# EAGLE schematic Main Board Schematic v13 (EAGLE 9.7.0)
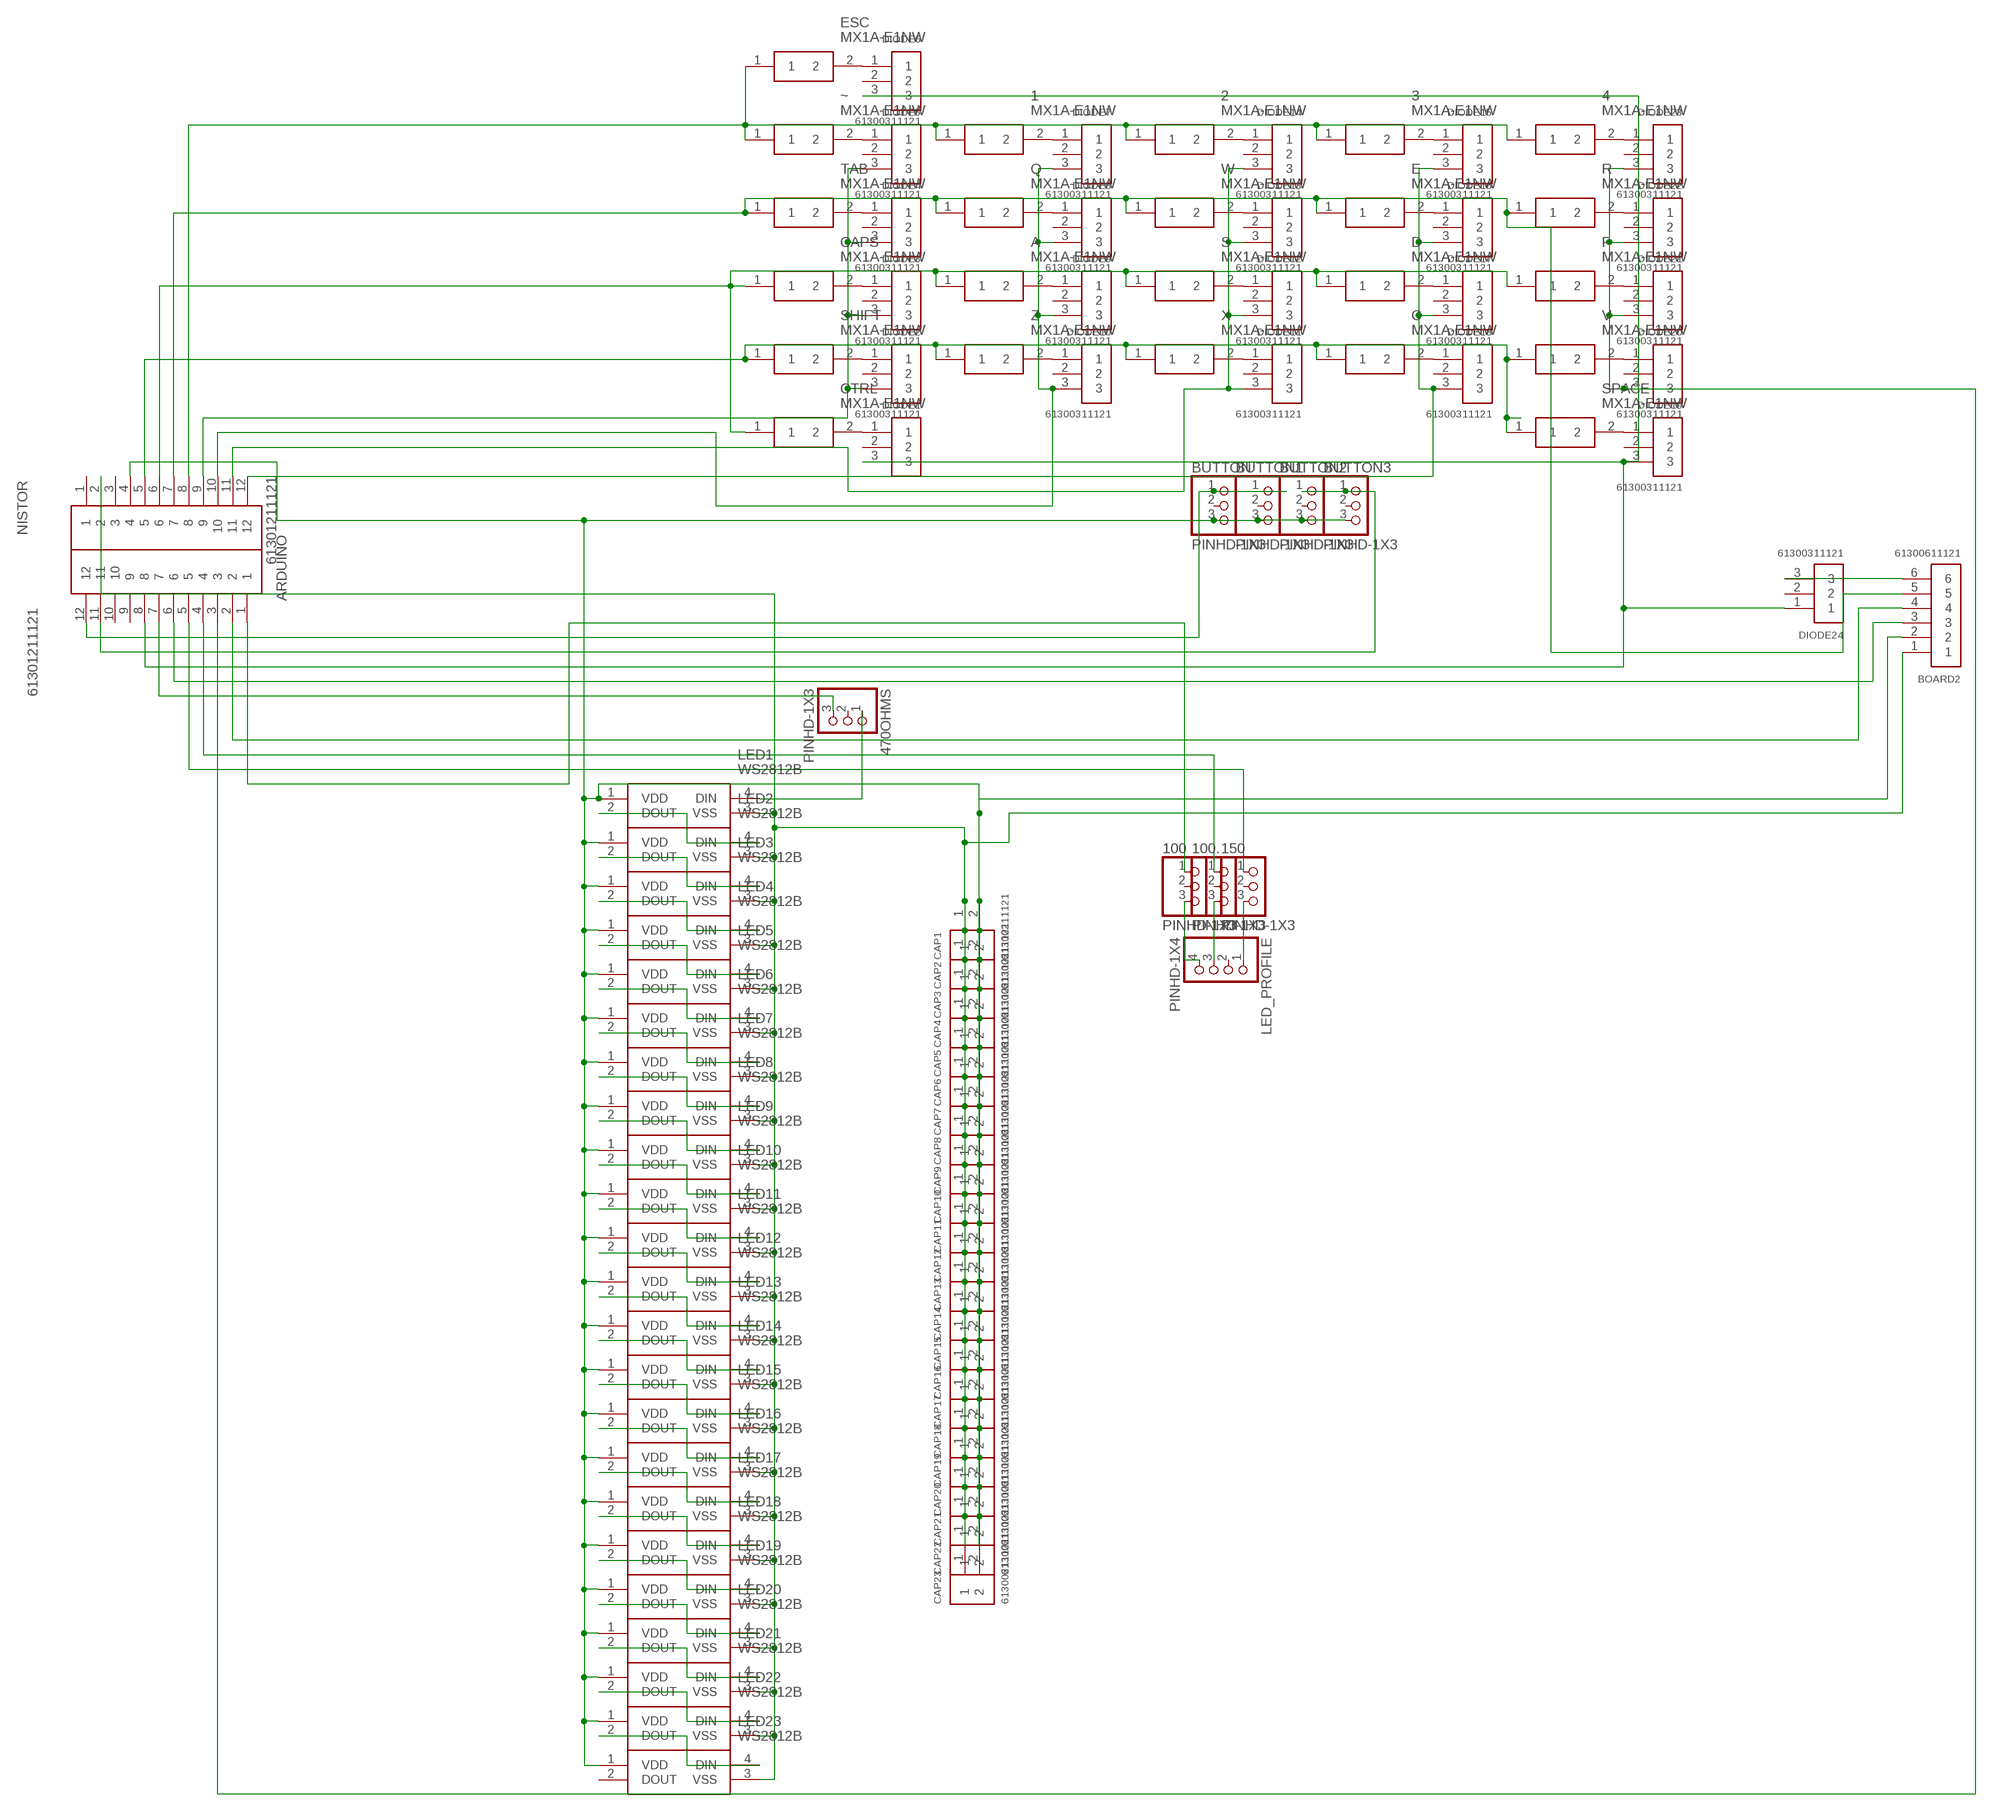
[diagram p0: schematic, sheet 1]

## Parts
1  MX1A-E1NW  [MX1AE1NW]
2  MX1A-E1NW  [MX1AE1NW]
3  MX1A-E1NW  [MX1AE1NW]
4  MX1A-E1NW  [MX1AE1NW]
100  PINHD-1X3  [1X03]
100.  PINHD-1X3  [1X03]
150  PINHD-1X3  [1X03]
470OHMS  PINHD-1X3  [1X03]
A  MX1A-E1NW  [MX1AE1NW]
ARDUINO  61301211121  [61301211121]
BOARD2  61300611121  [61300611121]
BUTTON  PINHD-1X3  [1X03]
BUTTON1  PINHD-1X3  [1X03]
BUTTON2  PINHD-1X3  [1X03]
BUTTON3  PINHD-1X3  [1X03]
C  MX1A-E1NW  [MX1AE1NW]
CAP1  61300211121  [61300211121]
CAP2  61300211121  [61300211121]
CAP3  61300211121  [61300211121]
CAP4  61300211121  [61300211121]
CAP5  61300211121  [61300211121]
CAP6  61300211121  [61300211121]
CAP7  61300211121  [61300211121]
CAP8  61300211121  [61300211121]
CAP9  61300211121  [61300211121]
CAP10  61300211121  [61300211121]
CAP11  61300211121  [61300211121]
CAP12  61300211121  [61300211121]
CAP13  61300211121  [61300211121]
CAP14  61300211121  [61300211121]
CAP15  61300211121  [61300211121]
CAP16  61300211121  [61300211121]
CAP17  61300211121  [61300211121]
CAP18  61300211121  [61300211121]
CAP19  61300211121  [61300211121]
CAP20  61300211121  [61300211121]
CAP21  61300211121  [61300211121]
CAP22  61300211121  [61300211121]
CAP23  61300211121  [61300211121]
CAPS  MX1A-E1NW  [MX1AE1NW]
CTRL  MX1A-E1NW  [MX1AE1NW]
D  MX1A-E1NW  [MX1AE1NW]
DIODE1  61300311121  [61300311121]
DIODE2  61300311121  [61300311121]
DIODE3  61300311121  [61300311121]
DIODE4  61300311121  [61300311121]
DIODE5  61300311121  [61300311121]
DIODE6  61300311121  [61300311121]
DIODE7  61300311121  [61300311121]
DIODE8  61300311121  [61300311121]
DIODE9  61300311121  [61300311121]
DIODE10  61300311121  [61300311121]
DIODE11  61300311121  [61300311121]
DIODE12  61300311121  [61300311121]
DIODE13  61300311121  [61300311121]
DIODE14  61300311121  [61300311121]
DIODE15  61300311121  [61300311121]
DIODE16  61300311121  [61300311121]
DIODE17  61300311121  [61300311121]
DIODE18  61300311121  [61300311121]
DIODE19  61300311121  [61300311121]
DIODE20  61300311121  [61300311121]
DIODE21  61300311121  [61300311121]
DIODE22  61300311121  [61300311121]
DIODE23  61300311121  [61300311121]
DIODE24  61300311121  [61300311121]
E  MX1A-E1NW  [MX1AE1NW]
ESC  MX1A-E1NW  [MX1AE1NW]
F  MX1A-E1NW  [MX1AE1NW]
LED1  WS2812B  [WS2812B]
LED2  WS2812B  [WS2812B]
LED3  WS2812B  [WS2812B]
LED4  WS2812B  [WS2812B]
LED5  WS2812B  [WS2812B]
LED6  WS2812B  [WS2812B]
LED7  WS2812B  [WS2812B]
LED8  WS2812B  [WS2812B]
LED9  WS2812B  [WS2812B]
LED10  WS2812B  [WS2812B]
LED11  WS2812B  [WS2812B]
LED12  WS2812B  [WS2812B]
LED13  WS2812B  [WS2812B]
LED14  WS2812B  [WS2812B]
LED15  WS2812B  [WS2812B]
LED16  WS2812B  [WS2812B]
LED17  WS2812B  [WS2812B]
LED18  WS2812B  [WS2812B]
LED19  WS2812B  [WS2812B]
LED20  WS2812B  [WS2812B]
LED21  WS2812B  [WS2812B]
LED22  WS2812B  [WS2812B]
LED23  WS2812B  [WS2812B]
LED_PROFILE  PINHD-1X4  [1X04]
NISTOR  61301211121  [61301211121]
Q  MX1A-E1NW  [MX1AE1NW]
R  MX1A-E1NW  [MX1AE1NW]
S  MX1A-E1NW  [MX1AE1NW]
SHIFT  MX1A-E1NW  [MX1AE1NW]
SPACE  MX1A-E1NW  [MX1AE1NW]
TAB  MX1A-E1NW  [MX1AE1NW]
V  MX1A-E1NW  [MX1AE1NW]
W  MX1A-E1NW  [MX1AE1NW]
X  MX1A-E1NW  [MX1AE1NW]
Z  MX1A-E1NW  [MX1AE1NW]
~  MX1A-E1NW  [MX1AE1NW]

## Nets
N$1: DIODE5.1 ~.2
N$2: DIODE6.1 ESC.2
N$3: DIODE4.1 TAB.2
N$4: CAPS.2 DIODE3.1
N$5: DIODE2.1 SHIFT.2
N$6: CTRL.2 DIODE1.1
N$7: DIODE11.1 X.2
N$8: DIODE12.1 S.2
N$9: DIODE13.1 W.2
N$10: 2.2 DIODE14.1
N$11: 3.2 DIODE15.1
N$12: DIODE16.1 E.2
N$13: D.2 DIODE17.1
N$14: C.2 DIODE18.1
N$15: 4.2 DIODE23.1
N$16: DIODE22.1 R.2
N$17: DIODE21.1 F.2
N$18: DIODE20.1 V.2
N$19: DIODE19.1 SPACE.2
N$20: 470OHMS.1 LED1.4(DIN)
N$21: A.1 CAPS.1 CTRL.1 D.1 F.1 NISTOR.6 S.1
N$22: BOARD2.5 E.1 NISTOR.7 Q.1 R.1 TAB.1 W.1
N$23: 1.1 2.1 3.1 4.1 ESC.1 NISTOR.8 ~.1
N$24: 470OHMS.3 ARDUINO.7
N$25: 1.2 DIODE7.1
N$26: DIODE8.1 Q.2
N$27: A.2 DIODE9.1
N$28: DIODE10.1 Z.2
N$29: DIODE7.3 DIODE8.3 DIODE9.3 DIODE10.3 NISTOR.10
N$30: DIODE11.3 DIODE12.3 DIODE13.3 DIODE14.3 NISTOR.11
N$31: DIODE15.3 DIODE16.3 DIODE17.3 DIODE18.3 NISTOR.12
N$32: ARDUINO.3 DIODE20.3 DIODE21.3 DIODE22.3 DIODE23.3
N$33: ARDUINO.8 DIODE1.3 DIODE6.3 DIODE19.3 DIODE24.1
N$34: ARDUINO.6 BOARD2.3
N$36: ARDUINO.2 BOARD2.4
N$37: BOARD2.6 DIODE24.3
N$38: 150.3 LED_PROFILE.1
N$39: ARDUINO.12 BUTTON1.1 BUTTON.1
N$40: 150.1 ARDUINO.5
N$41: BOARD2.2 BUTTON1.3 BUTTON2.3 BUTTON3.3 BUTTON.3 CAP1.2 CAP2.2 CAP3.2 CAP4.2 CAP5.2 CAP6.2 CAP7.2 CAP8.2 CAP9.2 CAP10.2 CAP11.2 CAP12.2 CAP13.2 CAP14.2 CAP15.2 CAP16.2 CAP17.2 CAP18.2 CAP19.2 CAP20.2 CAP21.2 CAP22.2 CAP23.2 LED1.1(VDD) LED2.1(VDD) LED3.1(VDD) LED4.1(VDD) LED5.1(VDD) LED6.1(VDD) LED7.1(VDD) LED8.1(VDD) LED9.1(VDD) LED10.1(VDD) LED11.1(VDD) LED12.1(VDD) LED13.1(VDD) LED14.1(VDD) LED15.1(VDD) LED16.1(VDD) LED17.1(VDD) LED18.1(VDD) LED19.1(VDD) LED20.1(VDD) LED21.1(VDD) LED22.1(VDD) LED23.1(VDD) NISTOR.4
N$42: 100..1 ARDUINO.4
N$43: BOARD2.1 CAP1.1 CAP2.1 CAP3.1 CAP4.1 CAP5.1 CAP6.1 CAP7.1 CAP8.1 CAP9.1 CAP10.1 CAP11.1 CAP12.1 CAP13.1 CAP14.1 CAP15.1 CAP16.1 CAP17.1 CAP18.1 CAP19.1 CAP20.1 CAP21.1 CAP22.1 CAP23.1 LED1.3(VSS) LED2.3(VSS) LED3.3(VSS) LED4.3(VSS) LED5.3(VSS) LED6.3(VSS) LED7.3(VSS) LED8.3(VSS) LED9.3(VSS) LED10.3(VSS) LED11.3(VSS) LED12.3(VSS) LED13.3(VSS) LED14.3(VSS) LED15.3(VSS) LED16.3(VSS) LED17.3(VSS) LED18.3(VSS) LED19.3(VSS) LED20.3(VSS) LED21.3(VSS) LED22.3(VSS) LED23.3(VSS) NISTOR.2
N$44: C.1 NISTOR.5 SHIFT.1 SPACE.1 V.1 X.1 Z.1
N$45: 100.1 ARDUINO.1
N$46: 100..3 LED_PROFILE.3
N$47: DIODE2.3 DIODE3.3 DIODE4.3 DIODE5.3 NISTOR.9
N$48: LED1.2(DOUT) LED2.4(DIN)
N$49: LED2.2(DOUT) LED3.4(DIN)
N$50: LED3.2(DOUT) LED4.4(DIN)
N$51: LED4.2(DOUT) LED5.4(DIN)
N$52: LED5.2(DOUT) LED6.4(DIN)
N$53: LED6.2(DOUT) LED7.4(DIN)
N$54: LED7.2(DOUT) LED8.4(DIN)
N$55: LED8.2(DOUT) LED9.4(DIN)
N$56: LED9.2(DOUT) LED10.4(DIN)
N$57: LED10.2(DOUT) LED11.4(DIN)
N$58: LED11.2(DOUT) LED12.4(DIN)
N$59: LED12.2(DOUT) LED13.4(DIN)
N$60: LED13.2(DOUT) LED14.4(DIN)
N$61: LED14.2(DOUT) LED15.4(DIN)
N$62: LED15.2(DOUT) LED16.4(DIN)
N$63: LED16.2(DOUT) LED17.4(DIN)
N$64: LED17.2(DOUT) LED18.4(DIN)
N$65: LED18.2(DOUT) LED19.4(DIN)
N$66: LED19.2(DOUT) LED20.4(DIN)
N$67: LED20.2(DOUT) LED21.4(DIN)
N$69: LED21.2(DOUT) LED22.4(DIN)
N$70: 100.3 LED_PROFILE.4
N$71: LED22.2(DOUT) LED23.4(DIN)
N$72: ARDUINO.11 BUTTON2.1 BUTTON3.1
Unconnected: 100.2 100..2 150.2 470OHMS.2 ARDUINO.9 ARDUINO.10 BUTTON1.2 BUTTON2.2 BUTTON3.2 BUTTON.2 DIODE1.2 DIODE2.2 DIODE3.2 DIODE4.2 DIODE5.2 DIODE6.2 DIODE7.2 DIODE8.2 DIODE9.2 DIODE10.2 DIODE11.2 DIODE12.2 DIODE13.2 DIODE14.2 DIODE15.2 DIODE16.2 DIODE17.2 DIODE18.2 DIODE19.2 DIODE20.2 DIODE21.2 DIODE22.2 DIODE23.2 DIODE24.2 LED23.2(DOUT) LED_PROFILE.2 NISTOR.1 NISTOR.3

## Library data of the parts
1-4 A C CAPS CTRL D E ESC F Q R S SHIFT SPACE TAB V W X Z ~ = SamacSys_Parts:MX1A-E1NW: Pushbutton Switches Full Travel, Mech. Keyswitch, Click Tactile Feel (Blue stem), 60cN, No LED, No Diode, Fixation Pins for PCB Mounting Source: Datasheet <https://media.digikey.com/pdf/Data Sheets/Cherry PDFs/MX Series.pdf>; DESCRIPTION: Pushbutton Switches Full Travel, Mech. Keyswitch, Click Tactile Feel (Blue stem), 60cN, No LED, No Diode, Fixation Pins for PCB Mounting; HEIGHT: 15.2mm; MANUFACTURER_NAME: Cherry; MANUFACTURER_PART_NUMBER: MX1A-E1NW; MOUSER_PART_NUMBER: 540-MX1A-E1NW; MOUSER_PRICE-STOCK: https://www.mouser.co.uk/ProductDetail/CHERRY/MX1A-E1NW/?qs=Z7NFYKyvgJd45Wm4xzFv7w%3D%3D
100 100. 150 470OHMS BUTTON BUTTON1-BUTTON3 = Connector:PINHD-1X3: PIN HEADER; CATEGORY: CONNECTOR; SUB-CATEGORY: PIN-HEADER
ARDUINO NISTOR = Headers:61301211121: CONN HEADER VERT 12POS 2.54MM Manufacturer's datasheet <https://katalog.we-online.de/em/datasheet/6130xx11121.pdf>; CREATED_BY: PCBLayout.com; DIGIKEY_PART_NUMBER: 732-5323-ND; MANUFACTURER: Wurth Electronics Inc.; MPN: 61301211121
BOARD2 = Headers:61300611121: CONN HEADER VERT 6POS 2.54MM Manufacturer's datasheet <https://katalog.we-online.de/em/datasheet/6130xx11121.pdf>; CREATED_BY: PCBLayout.com; DIGI_KEY_PART_NUMBER: 732-5319-ND; MANUFACTURER: Wurth Electronics Inc.; MPN: 61300611121
CAP1-CAP23 = Headers:61300211121: CONN HEADER VERT 2POS 2.54MM Manufacturer's datasheet <https://katalog.we-online.de/em/datasheet/6130xx11121.pdf>; CREATED_BY: PCBLayout.com; DIGI_KEY_PART_NUMBER: 732-5315-ND; MANUFACTURER: Wurth Electronics Inc.; MPN: 61300211121
DIODE1-DIODE24 = Headers:61300311121: CONN HEADER VERT 3POS 2.54MM Manufacturer's datasheet <https://katalog.we-online.de/em/datasheet/6130xx11121.pdf>; CREATED_BY: PCBLayout.com; DIGI_KEY_PART_NUMBER: 732-5316-ND; MANUFACTURER: Wurth Electronics Inc.; MPN: 61300311121
LED1-LED23 = WS2812B:WS2812B: Intelligent control LED integrated light source Source: Datasheet <https://www.adafruit.com/datasheets/WS2812B.pdf>; DESCRIPTION: Intelligent control LED integrated light source; HEIGHT: mm; MANUFACTURER_NAME: Worldsemi; MANUFACTURER_PART_NUMBER: WS2812B
LED_PROFILE = Connector:PINHD-1X4: PIN HEADER; CATEGORY: CONNECTOR; SUB-CATEGORY: PIN-HEADER